# Altium schematic sheet 03_ADC.SchDoc
size 513 x 386 mm
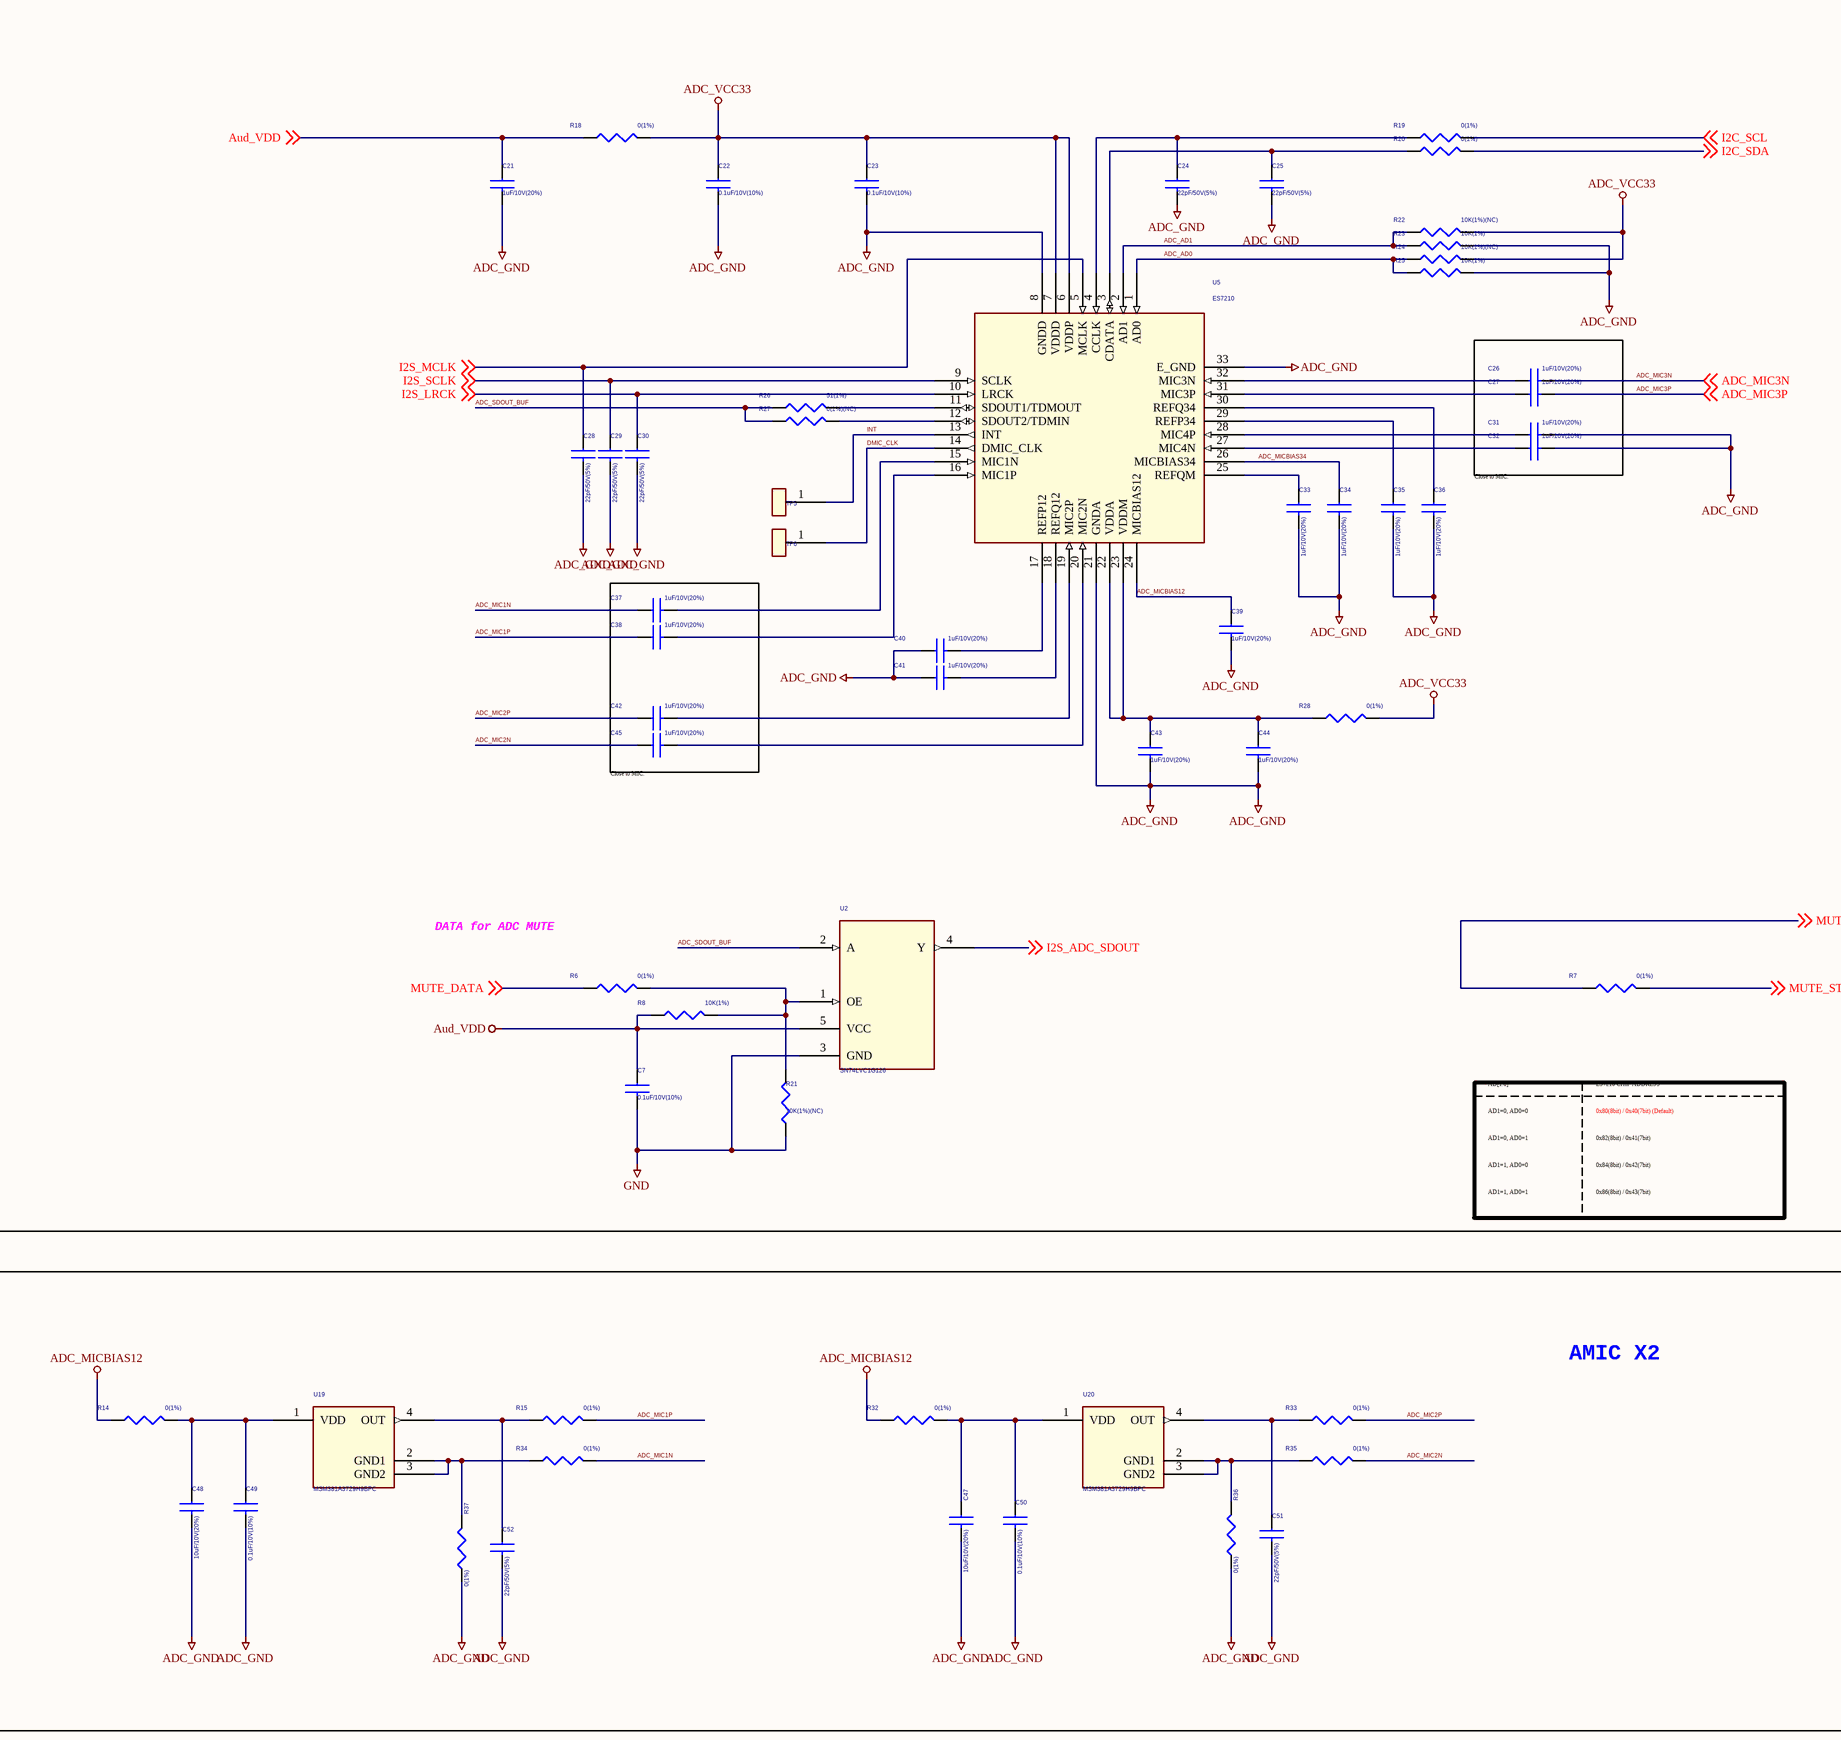
[diagram p0: 03_ADC.SchDoc, left]
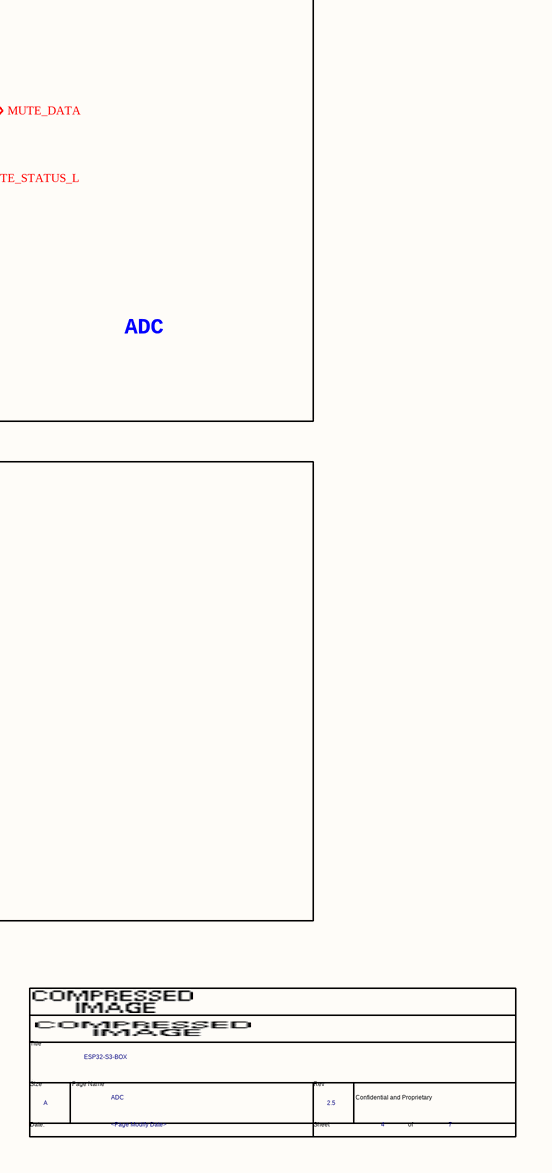
[diagram p1: 03_ADC.SchDoc, right]

## Parts
*  Page Modify Date: <Page Modify Date>  Page Name: ADC  Title: ESP32-S3-BOX  Page Size: A  Page Number: 4  Page Count: 7  RevCode: 2.5  (hidden comment: espTitleBlock3)  (graphical)
C7  0.1uF/10V(10%)  [0201_C]
C21  1uF/10V(20%)  [0201_C]
C22  0.1uF/10V(10%)  [0201_C]
C23  0.1uF/10V(10%)  [0201_C]
C24  22pF/50V(5%)  [0201_C]
C25  22pF/50V(5%)  [0201_C]
C26  1uF/10V(20%)  [0201_C]
C27  1uF/10V(20%)  [0201_C]
C28  22pF/50V(5%)  [0201_C]
C29  22pF/50V(5%)  [0201_C]
C30  22pF/50V(5%)  [0201_C]
C31  1uF/10V(20%)  [0201_C]
C32  1uF/10V(20%)  [0201_C]
C33  1uF/10V(20%)  [0201_C]
C34  1uF/10V(20%)  [0201_C]
C35  1uF/10V(20%)  [0201_C]
C36  1uF/10V(20%)  [0201_C]
C37  1uF/10V(20%)  [0201_C]
C38  1uF/10V(20%)  [0201_C]
C39  1uF/10V(20%)  [0201_C]
C40  1uF/10V(20%)  [0201_C]
C41  1uF/10V(20%)  [0201_C]
C42  1uF/10V(20%)  [0201_C]
C43  1uF/10V(20%)  [0201_C]
C44  1uF/10V(20%)  [0201_C]
C45  1uF/10V(20%)  [0201_C]
C47  10uF/10V(20%)  [0402_C]
C48  10uF/10V(20%)  [0402_C]
C49  0.1uF/10V(10%)  [0201_C]
C50  0.1uF/10V(10%)  [0201_C]
C51  22pF/50V(5%)  [0201_C]
C52  22pF/50V(5%)  [0201_C]
R6  0(1%)  [0201_R]
R7  0(1%)  [0402_R]
R8  10K(1%)  [0201_R]
R14  0(1%)  [0402_R]
R15  0(1%)  [0201_R]
R18  0(1%)  [0402_R]
R19  0(1%)  [0201_R]
R20  0(1%)  [0201_R]
R21  10K(1%)(NC)  [0201_R]
R22  10K(1%)(NC)  [0201_R]
R23  10K(1%)  [0201_R]
R24  10K(1%)(NC)  [0201_R]
R25  10K(1%)  [0201_R]
R26  51(1%)  [0201_R]
R27  0(1%)(NC)  [0201_R]
R28  0(1%)  [0402_R]
R32  0(1%)  [0402_R]
R33  0(1%)  [0201_R]
R34  0(1%)  [0201_R]
R35  0(1%)  [0201_R]
R36  0(1%)  [0201_R]
R37  0(1%)  [0201_R]
TP5  TESTPOINT  [TPC_D40]  (value not drawn)
TP6  TESTPOINT  [TPC_D40]  (value not drawn)
U2  SN74LVC1G126  [SC-70-5]
U5  ES7210  [QFN-32_5x5x05P]
U19  MSM381A3729H9BPC  [MSM381]
U20  MSM381A3729H9BPC  [MSM381]

## Blocks framed on the sheet
ADC: C7 C21-C45 R6-R8 R18-R28 TP5 TP6 U2 U5
AMIC X2: C47-C52 R14 R15 R32-R37 U19 U20

## Nets
ADC_GND: C21.2 C22.2 C23.2 C24.2 C25.2 C28.2 C29.2 C30.2 C31.2 C32.2 C33.2 C34.2 C35.2 C36.2 C39.2 C40.1 C41.1 C43.2 C44.2 C47.2 C48.2 C49.2 C50.2 C51.2 C52.2 R23.2 R25.2 R36.1 R37.1 U5.8(GNDD) U5.21(GNDA) U5.33(E_GND)
ADC_MICBIAS12: C39.1 R14.1 R32.1 U5.24(MICBIAS12)
ADC_VCC33: C22.1 C23.1 R18.2 R22.2 R24.2 R28.2 U5.6(VDDP) U5.7(VDDD)
Aud_VDD: C7.1 C21.1 R8.1 R18.1 U2.5(VCC) ; off-sheet Aud_VDD
GND: C7.2 R21.1 U2.3(GND)
ADC_AD0: R24.1 R25.1 U5.1(AD0)
ADC_AD1: R22.1 R23.1 U5.2(AD1)
ADC_MIC1N: C37.1 R34.2
ADC_MIC1P: C38.1 R15.2
ADC_MIC2N: C45.1 R35.2
ADC_MIC2P: C42.1 R33.2
ADC_MIC3N: C26.2 ; off-sheet ADC_MIC3N
ADC_MIC3P: C27.2 ; off-sheet ADC_MIC3P
ADC_MICBIAS34: C34.1 U5.26(MICBIAS34)
ADC_SDOUT_BUF: R26.1 R27.1 U2.2(A)
DMIC_CLK: TP6.1 U5.14(DMIC_CLK)
I2C_SCL: R19.2 ; off-sheet I2C_SCL
I2C_SDA: R20.2 ; off-sheet I2C_SDA
I2S_ADC_SDOUT: U2.4(Y) ; off-sheet I2S_ADC_SDOUT
I2S_LRCK: C30.1 U5.10(LRCK) ; off-sheet I2S_LRCK
I2S_MCLK: C28.1 U5.5(MCLK) ; off-sheet I2S_MCLK
I2S_SCLK: C29.1 U5.9(SCLK) ; off-sheet I2S_SCLK
INT: TP5.1 U5.13(INT)
MUTE_DATA: R6.1 R7.1 ; off-sheet MUTE_DATA
MUTE_STATUS_L: R7.2 ; off-sheet MUTE_STATUS_L
NetC24_1: C24.1 R19.1 U5.4(CCLK)
NetC25_1: C25.1 R20.1 U5.3(CDATA)
NetC26_1: C26.1 U5.32(MIC3N)
NetC27_1: C27.1 U5.31(MIC3P)
NetC31_1: C31.1 U5.28(MIC4P)
NetC32_1: C32.1 U5.27(MIC4N)
NetC33_1: C33.1 U5.25(REFQM)
NetC35_1: C35.1 U5.29(REFP34)
NetC36_1: C36.1 U5.30(REFQ34)
NetC37_2: C37.2 U5.15(MIC1N)
NetC38_2: C38.2 U5.16(MIC1P)
NetC40_2: C40.2 U5.17(REFP12)
NetC41_2: C41.2 U5.18(REFQ12)
NetC42_2: C42.2 U5.19(MIC2P)
NetC43_1: C43.1 C44.1 R28.1 U5.22(VDDA) U5.23(VDDM)
NetC45_2: C45.2 U5.20(MIC2N)
NetC47_1: C47.1 C50.1 R32.2 U20.1(VDD)
NetC48_1: C48.1 C49.1 R14.2 U19.1(VDD)
NetC51_1: C51.1 R33.1 U20.4(OUT)
NetC52_1: C52.1 R15.1 U19.4(OUT)
NetR6_2: R6.2 R8.2 R21.2 U2.1(OE)
NetR26_2: R26.2 U5.11(SDOUT1/TDMOUT)
NetR27_2: R27.2 U5.12(SDOUT2/TDMIN)
NetR34_1: R34.1 R37.2 U19.2(GND1) U19.3(GND2)
NetR35_1: R35.1 R36.2 U20.2(GND1) U20.3(GND2)

## Notes on the sheet
- Close to MIC.
- (near C45) Close to MIC.
- DATA for ADC MUTE
- AD[1:0]
- ES7210 CHIP ADDRESS
- AD1=0, AD0=0
- AD1=0, AD0=1
- AD1=1, AD0=0
- 0x80(8bit) / 0x40(7bit) (Default)
- 0x82(8bit) / 0x41(7bit)
- 0x84(8bit) / 0x42(7bit)
- AD1=1, AD0=1
- 0x86(8bit) / 0x43(7bit)
- (in symbol espTitleBlock3) Title; Size; Page Name; Rev; Confidential and Proprietary; Date:; Sheet; of

## Library data of the parts
* = espTitleBlock3: Doc: ESP32-S3-EYE_V1.0; OrgName: ESPRESSIF
C7 C22 C23 C49 C50 = CAPACITOR: Part Number: ES11025103610001; CODE12: ES11.02.510.3.6.1.00; Part Type: Capacitor
C21 C26 C27 C31-C45 = CAPACITOR: Part Number: ES11026103700001; CODE12: ES11.02.610.3.7.0.00; Part Type: Capacitor
C24 C25 C28-C30 C51 C52 = CAPACITOR: Part Number: ES11021226520000; CODE12: ES11.02.122.6.5.2.00; Part Type: Capacitor
C47 C48 = CAPACITOR: Part Number: ES11047103700000; CODE12: ES11.04.710.3.7.0.00; Part Type: Capacitor
R6 R15 R19 R20 R27 R33-R37 = RESISTOR: Part Number: ES21020000000001; CODE12: ES21.02.0000.0.00.0; Part Type: Resistor
R7 R14 R18 R28 R32 = RESISTOR: Part Number: ES21040000000001; CODE12: ES21.04.0000.0.00.0; Part Type: Resistor
R8 R21-R25 = RESISTOR: Part Number: ES21024100000001; CODE12: ES21.02.4100.0.00.0; Part Type: Resistor
R26 = RESISTOR: Part Number: ES21021510000001; CODE12: ES21.02.1510.0.00.0; Part Type: Resistor
TP5 TP6 = TESTPOINT: Part Number: ES51990010000000; CODE12: ES51.99.0010.00.00; Part Type: -
U5 = ES7210: Part Number: ES41181401000000; CODE12: ES41.18.14.01.00.00; Part Type: Audio ICs
U19 U20 = MSM381A3729H9BPC: Part Number: ES41180800000000; CODE12: ES41.18.08.00.00.00; Part Type: MICs